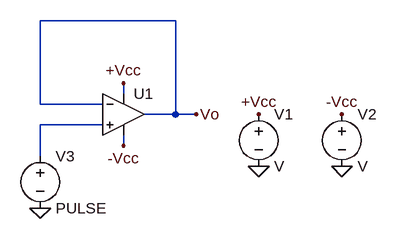
[diagram p0: schematic Slew Rate.asc]
Slew Rate.asc, the LTspice schematic file:
Version 4
SHEET 1 880 680
WIRE 384 192 176 192
WIRE 304 304 304 288
WIRE 176 320 176 192
WIRE 272 320 176 320
WIRE 384 336 384 192
WIRE 384 336 336 336
WIRE 416 336 384 336
WIRE 272 352 176 352
WIRE 304 384 304 368
WIRE 176 400 176 352
FLAG 512 416 0
FLAG 640 416 0
FLAG 512 336 +Vcc
FLAG 640 336 -Vcc
FLAG 304 288 +Vcc
FLAG 304 384 -Vcc
FLAG 416 336 Vo
FLAG 176 480 0
SYMBOL OpAmps/UniversalOpAmp 304 336 R0
SYMATTR InstName U1
SYMBOL Voltage 512 320 R0
SYMATTR InstName V1
SYMBOL Voltage 640 320 R0
SYMATTR InstName V2
SYMBOL Voltage 176 384 R0
SYMATTR InstName V3
SYMATTR Value PULSE

The netlist it stands for:
* Slew Rate.asc
XU1 N001 Vo +Vcc -Vcc Vo level1 Avol=1Meg GBW=10Meg Vos=0 En=0 Enk=0 In=0 Ink=0 Rin=500Meg  ; pins In+ In- V+ V- OUT
V1 +Vcc 0 V
V2 -Vcc 0 V
V3 N001 0 PULSE
.lib UniversalOpAmp1.lib
.backanno
.end